# Altium project ESP32C6-Xbee.PrjPcb
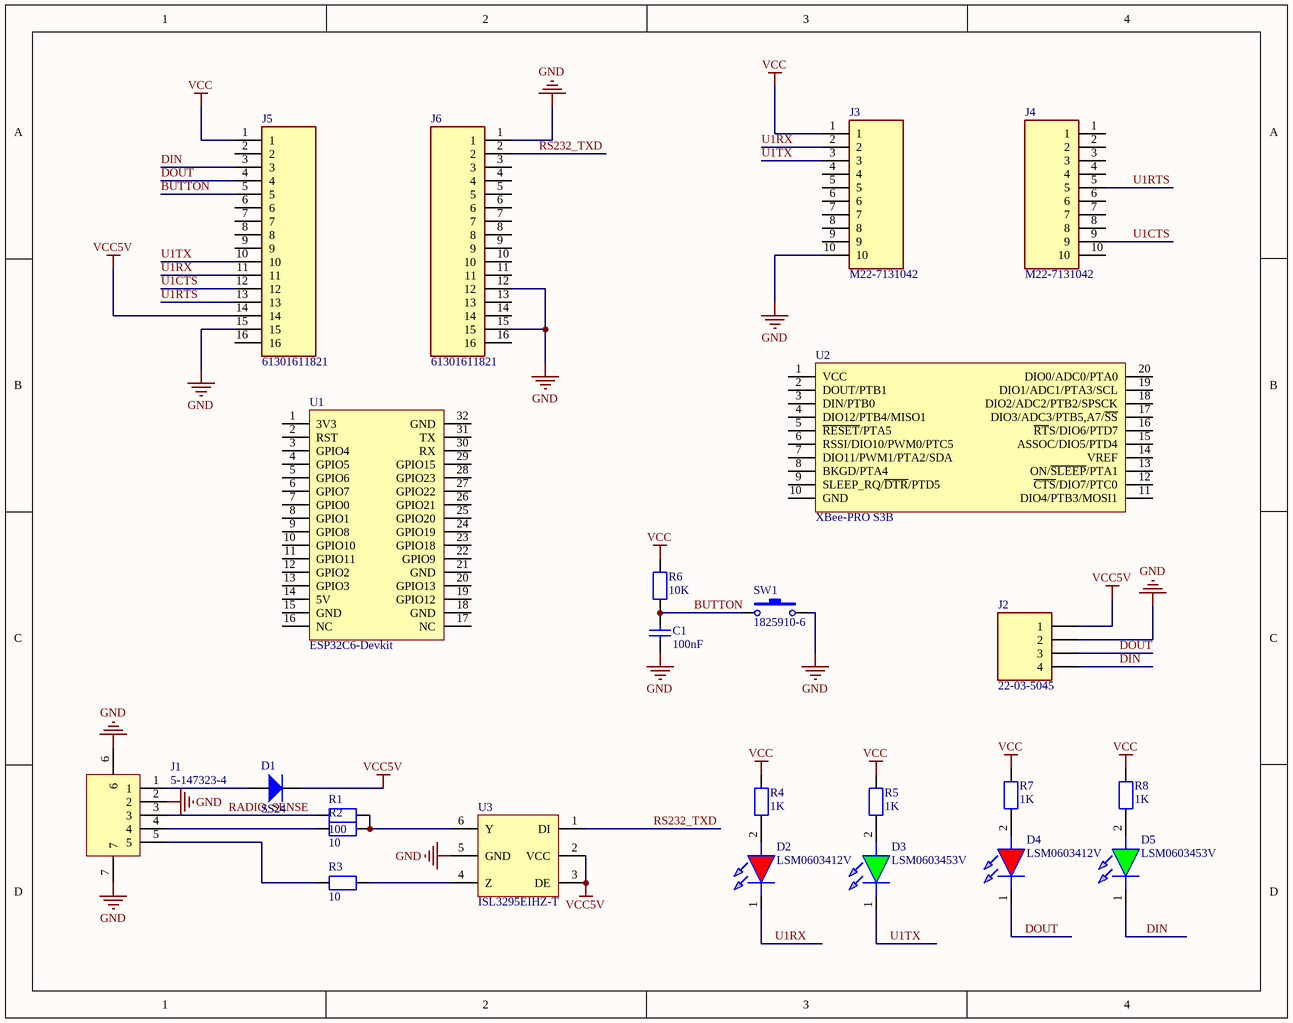
[diagram p0: ESP32C6_Xbee.SchDoc]
1 sheet, 24 parts. Net scope: global (net labels, ports and power ports of the same name join across sheets).
Board file: ESP32C6_Xbee.PcbDoc

## Sheet ESP32C6_Xbee.SchDoc
size A; SheetNumber: 1; SheetTotal: 1

### Parts
C1  100nF  [C0603]
D1  SS24  [DO-214AA]
D2  LSM0603412V  [LSM0603412V]
D3  LSM0603453V  [LEDC1608X55N]
D4  LSM0603412V  [LSM0603412V]
D5  LSM0603453V  [LEDC1608X55N]
J1  5-147323-4  [5-147323-4]
J2  22-03-5045  [MOLEX_22-03-5045]
J3  M22-7131042  [M22-7131042]
J4  M22-7131042  [M22-7131042]
J5  61301611821  [61301611821]
J6  61301611821  [61301611821]
R1  100  [R0603]
R2  10  [R0603]
R3  10  [R0603]
R4  1K  [R0603]
R5  1K  [R0603]
R6  10K  [R0603]
R7  1K  [R0603]
R8  1K  [R0603]
SW1  1825910-6  [SW_1825910-6-4]
U1  ESP32C6-Devkit  [ESP32-C6-Devkit]
U2  XBee-PRO S3B  [XBEE(MMS-110-02-L-SV-K-TR)]
U3  ISL3295EIHZ-T  [SOT23-6]

### Nets
GND: C1.1 J1.2 J1.6 J1.7 J2.2 J3.10 J5.15 J6.1 J6.12 J6.15 SW1.2 U3.5(GND)
VCC: J3.1 J5.1 R4.2 R5.2 R6.2 R7.2 R8.2
VCC5V: D1.2 J2.1 J5.14 U3.2(VCC) U3.3(DE)
BUTTON: C1.2 J5.5 R6.1 SW1.1
DIN: D5.1(K) J2.4 J5.3
DOUT: D4.1(K) J2.3 J5.4
RADIO_SENSE: J1.3 R1.1
RS232_TXD: J6.2 U3.1(DI)
U1CTS: J4.9 J5.12
U1RTS: J4.5 J5.13
U1RX: D2.1(K) J3.2 J5.11
U1TX: D3.1(K) J3.3 J5.10
NetD1_1: D1.1 J1.1
NetD2_2: D2.2(A) R4.1
NetD3_2: D3.2(A) R5.1
NetD4_2: D4.2(A) R7.1
NetD5_2: D5.2(A) R8.1
NetJ1_4: J1.4 R2.1
NetJ1_5: J1.5 R3.1
NetR1_2: R1.2 R2.2 U3.6(Y)
NetR3_2: R3.2 U3.4(Z)

Not connected (* = marked no-connect by the designer): J3 4 5 6 7 8 9; J4 1 2 3 4 6 7 8 10; J5 2 6 7 8 9 16; J6 3 4 5 6 7 8 9 10 11 13 14 16; U1 1(3V3) 2(RST) 3(GPIO4) 4(GPIO5) 5(GPIO6) 6(GPIO7) 7(GPIO0) 8(GPIO1) 9(GPIO8) 10(GPIO10) 11(GPIO11) 12(GPIO2) 13(GPIO3) 14(5V) 15(GND) 16(NC) 17(NC) 18(GND) 19(GPIO12) 20(GPIO13) 21(GND) 22(GPIO9) 23(GPIO18) 24(GPIO19) 25(GPIO20) 26(GPIO21) 27(GPIO22) 28(GPIO23) 29(GPIO15) 30(RX) 31(TX) 32(GND); U2 1(VCC) 2(DOUT/PTB1) 3(DIN/PTB0) 4(DIO12/PTB4/MISO1) 5(~{RESET}/PTA5) 6(RSSI/DIO10/PWM0/PTC5) 7(DIO11/PWM1/PTA2/SDA) 8(BKGD/PTA4) 9(SLEEP_RQ/~{DTR}/PTD5) 10(GND) 11(DIO4/PTB3/MOSI1) 12(~{CTS}/DIO7/PTC0) 13(ON/~{SLEEP}/PTA1) 14(VREF) 15(ASSOC/DIO5/PTD4) 16(~{RT}S/DIO6/PTD7) 17(DIO3/ADC3/PTB5,A7/~{SS}) 18(DIO2/ADC2/PTB2/SPSCK) 19(DIO1/ADC1/PTA3/SCL) 20(DIO0/ADC0/PTA0)

### Library data of the parts
C1 = 100nF ± 10% 50V: 0.1 µF ±10% 50V Ceramic Capacitor X7R 0603 (1608 Metric); Manufacturer: Yageo; Manufacturer Part Number: CS0603KRX7R9BB104; Value: 100nF; Supplier: Digi-key; Supplier Part Number: 311-3568-2-ND; Price: 0.14
D1 = SS24: Schottky Diodes & Rectifiers 2A, 40V, Schottky Rectifier; Manufacturer: Taiwan Semiconductor; Supplier Part Number: SS24FSTR-ND; Supplier: Digi-key; Manufacturer Part Number: SS24; Price: 0.37; Value: SS24
D2 D4 = LSM0603412V: Red 635nm LED Indication - Discrete 2V 0603 (1608 Metric); Manufacturer: Visual Communications Company; Supplier Part Number: LSM0603412VTR-ND; Supplier: Digi-key; Manufacturer Part Number: LSM0603412V; Value: LSM0603412V; Price: 0.4
D3 D5 = LSM0603453V: Standard LEDs - SMD SMD 0603 3V 1000mcd GREEN; Manufacturer: Visual Communications Company; Supplier Part Number: LSM0603453VTR-ND; Supplier: Digi-key; Manufacturer Part Number: LSM0603453V; Price: 0.4; Value: LSM0603453V
J1 = 5-147323-4: Connector Header Surface Mount, Right Angle 5 position 0.100" (2.54mm); Manufacturer: TE Connectivity; Supplier Part Number: A120814TR-ND; Supplier: Digi-key; Manufacturer Part Number: 5-147323-4; Price: 6.3; Value: 5-147323-4
J2 = 22-03-5045: Headers & Wire Housings 2.5 VERT HDR SPOX 4P shrouded; Manufacturer: Molex; Value: 4P con; Manufacturer Part Number: 22-03-5045; Supplier: Mouser; Supplier Part Number: 538-22-03-5045; Price: 22-03-5045
J3 J4 = M22-7131042: 2.00mm (0.079") Pitch SIL Vertical 2.6mm Throughboard Socket Assembly, selective gold + tin, 10 contacts; Manufacturer: Harwin; Geometry.Height: 4.4mm; Supplier Part Number: 952-1354-5-ND; Supplier: Digi-key; Manufacturer Part Number: M22-7131042; Price: 1.9; Value: M22-7131042
J5 J6 = 61301611821: 16 Position Header Connector 0.100" (2.54mm) Through Hole Gold; Manufacturer: Wurth Elektronik; Geometry.Height: 8.65mm; Value: 1Row 16Pin; Supplier Part Number: 61301611821-ND; Supplier: Digi-key; Manufacturer Part Number: 61301611821; Price: 0.68
R1 = 100 Ohms ±1% 0.1W: 100 Ohms ±1% 0.1W, 1/10W Chip Resistor 0603 (1608 Metric) Moisture Resistant Thick Film; Manufacturer: Yageo; Manufacturer Part Number: RC0603FR-07100RL; Value: 100; Supplier: Digi-key; Supplier Part Number: 311-100HRTR-ND; Price: 0.1
R2 R3 = 10 Ohms ±1% 0.1W: 10 Ohms ±1% 0.1W, 1/10W Chip Resistor 0603 (1608 Metric) Moisture Resistant Thick Film; Manufacturer: Yageo; Manufacturer Part Number: RC0603FR-0710RL; Value: 10; Supplier: Diogi-key; Supplier Part Number: 311-10.0HRTR-ND; Price: 0.1
R4 R5 R7 R8 = 1K Ohms ±1% 0.1W: 1 kOhms ±1% 0.1W, 1/10W Chip Resistor 0603 (1608 Metric) Moisture Resistant Thick Film; Manufacturer: Yageo; Manufacturer Part Number: RC0603FR-071KL; Value: 1K; Supplier: Digi-key; Supplier Part Number: 311-1.00KHRTR-ND; Price: 0.1
R6 = 10K Ohms ±1% 0.1W: 10 kOhms ±1% 0.1W, 1/10W Chip Resistor 0603 (1608 Metric) Moisture Resistant Thick Film; Manufacturer: Yageo; Manufacturer Part Number: RC0603FR-0710KL; Value: 10K; Supplier: Digi-key; Supplier Part Number: 311-10.0KHRTR-ND; Price: 0.1
SW1 = 1825910-6: Tactile Switch SPST-NO Top Actuated Through Hole; Manufacturer: TE Connectivity; Value: 1825910-6; Manufacturer Part Number: 1825910-6; Price: 0.13; Supplier: Digi-key; Supplier Part Number: 450-1650-ND
U1 = ESP32C6-Devkit: ESP32-C6-MINI-1 Transceiver; Bluetooth® 5 2.4GHz Evaluation Board; Manufacturer: Espressif Systems; Manufacturer Part Number: ESP32-C6-DevKitM-1-N4; Value: No FIT; Supplier Part Number: 1965-ESP32-C6-DEVKITM-1-N4-ND; Supplier: Digi-key; Price: 8
U2 = XBee-PRO S3B: General ISM < 1GHz Transceiver Module 920MHz Antenna Not Included, RP-SMA Through Hole; Manufacturer: DIGI; Manufacturer Part Number: XBP9B-XCST-022; Value: No FIT; Supplier Part Number: 602-1353-ND; Supplier: Digi-key; Price: 58.5
U3 = ISL3295EIHZ-T: 1/0 Driver RS422, RS485 6-SOT; Manufacturer: Renesas Electronics America Inc; Manufacturer Part Number: ISL3295EIHZ-T; Supplier: Digi-key; Supplier Part Number: ISL3295EIHZ-TTR-ND; Price: 1.67; Value: ISL3295EIHZ-T